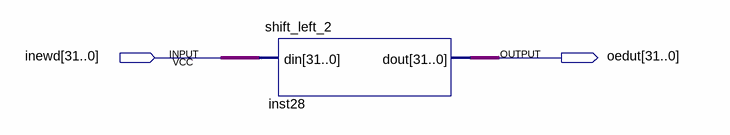
[diagram p0: schematic sheet]
// Quartus schematic test_edgedetector.bdf as structural Verilog: 1 symbols, 2 pins
module test_edgedetector (
  input  [31:0] inewd,
  output [31:0] oedut
);

  shift_left_2 inst28 (.din(inewd), .dout(oedut));
endmodule
